# EAGLE design 10w_Adapter (EAGLE 9.4.2)
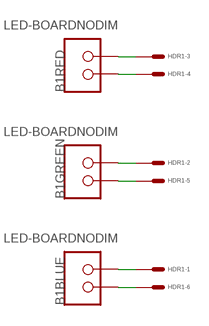
[diagram p0: schematic, sheet 1]

## Parts
B1  LED-BOARDNODIM  [LED_BOARD_V5_A]
HDR1  M06LOCK  [1X06_LOCK]

## Nets
N$1: B1.R- B1.R-@1 HDR1.3
N$2: B1.R+ B1.R+@1 HDR1.4
N$3: B1.G- B1.G-@1 HDR1.2
N$4: B1.G+ B1.G+@1 HDR1.5
N$5: B1.B- B1.B-@1 HDR1.1
N$6: B1.B+ B1.B+@2 HDR1.6

## Library data of the parts
B1 = myBoards:LED-BOARD
HDR1 = headers:M06: Header 6 Standard 6-pin 0.1" header. Use with straight break away headers (SKU : PRT-00116), right angle break away headers (PRT-00553), swiss pins (PRT-00743), machine pins (PRT-00117), and female headers (PRT-00115). Molex polarized connector foot print use with SKU : PRT-08094 with associated crimp pins and housings. NOTES ON THE VARIANTS LOCK and LOCK_LONGPADS... This footprint was designed to help hold the alignment of a through-hole component (i.e. 6-pin header) while soldering it into place. You may notice that each hole has been shifted either up or down by 0.005 of an inch from it's more standard position (which is a perfectly straight line). This slight alteration caused the pins (the squares in the middle) to touch the edges of the holes. Because they are alternating, it causes a "brace" to hold the component in place. 0.005 has proven to be the perfect amount of "off-center" position when using our standard breakaway headers. Although looks a little odd when you look at the bare footprint, once you have a header in there, the alteration is very hard to notice. Also, if you push a header all the way into place, it is covered up entirely on the bottom side. This idea of altering the position of holes to aid alignment will be further integrated into the Sparkfun Library for other footprints. It can help hold any component with 3 or more connection pins.

## Board
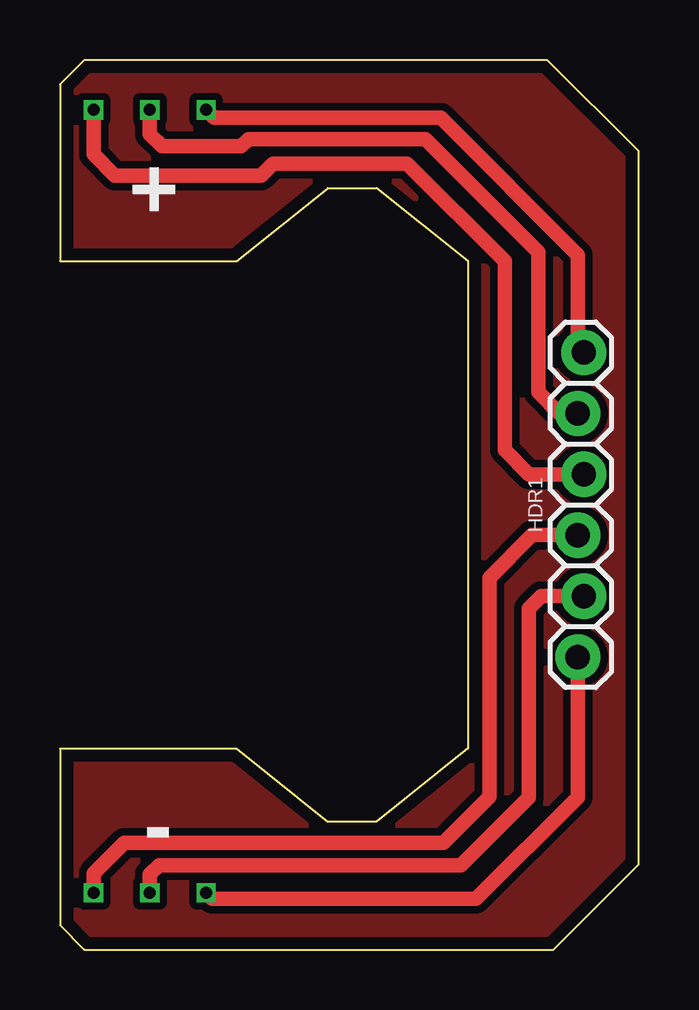
[diagram p1: board, top side]
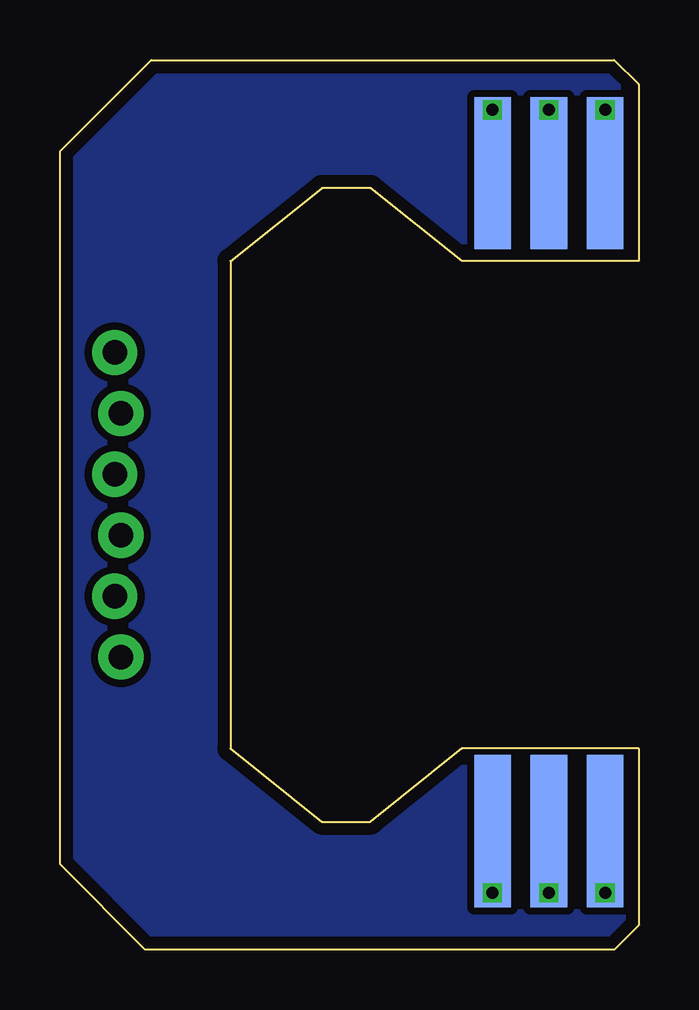
[diagram p2: board, bottom side, seen from below]

Size 24.13 x 37.08 mm. Coordinates in mm from the lower left corner, seen from the top.
Outline: 1.02,0 20.57,0 24.13,3.56 24.13,33.27 20.32,37.08 1.02,37.08 0,36.07 0,28.7 7.37,28.7 11.18,31.75 13.21,31.75 17.02,28.7 17.02,8.38 13.21,5.33 11.18,5.33 7.37,8.38 0,8.38 0,1.02 1.02,0
Copper layers (1*16): Top 0.035mm / dielectric 1.6mm / Bottom 0.035mm
Design rules "Elecrow_2-layer_PCB_eagle_rule": minimum track width 6mil, minimum drill 12mil, track to track 6mil, track to pad 6mil, pad to pad 6mil, via to via 8mil, smd to smd 6mil, copper to edge 20mil, drill to drill 10mil, minimum pad ring 6mil, minimum via ring 6mil, stop-mask expansion 0mil, vias tented up to drill 100mil, thermal gap 10mil

### Footprints (pad centres in the part's own frame; a part is rotated, then mirrored left to right if it is on the bottom)
LED_BOARD_V5_A = smd 1.524 x 6.35 bottom: B+ 6.095,36.683; B- 6.095,9.251; G+ 3.746,36.683; G- 3.746,9.251; R+ 1.396,36.683; R- 1.396,9.251 | drill 0.5 square: B+@2 6.095,39.324; B-@1 6.095,6.685; G+@1 3.746,39.324; G-@1 3.746,6.685; R+@1 1.396,39.324; R-@1 1.396,6.685
1X06_LOCK = drill 1.016 pad 1.88: 1 -6.35,0; 2 -3.81,-0.254; 3 -1.27,0; 4 1.27,-0.254; 5 3.81,0; 6 6.35,-0.254

### Placement (x,y rotation side)
B1  0,-4.32 0 top
HDR1  21.59,18.54 90 top

### Tracks (layer width: path | path; a pad name or v marks a point on that pad's centre or on a via)
GND
  pour Top (isolate 0.305): 0,1.27 0,1.02 1.02,0 20.57,0 24.13,3.68 24.13,33.27 20.32,37.08 1.02,37.08 0,36.07 0,28.7 7.37,28.7 11.18,31.75 13.21,31.75 17.02,28.7 17.02,8.38 13.21,5.33 11.18,5.33 7.37,8.38 0,8.38
  pour Bottom (isolate 0.305): 0,1.27 0,1.02 1.02,0 20.57,0 24.13,3.68 24.13,33.27 20.32,37.08 1.02,37.08 0,36.07 0,28.7 7.37,28.7 11.18,31.75 13.21,31.75 17.02,28.7 17.02,8.38 13.21,5.33 11.18,5.33 7.37,8.38 0,8.38
N$1
  Top 0.61: B1.R-@1 1.4,3.17 2.67,4.45 15.99,4.45 17.9,6.37 17.9,15.49 19.68,17.27 HDR1.3
  Bottom 0.61: B1.R- B1.R-@1
N$2
  Top 0.61: B1.R+@1 1.4,33.15 2.29,32.26 8.38,32.26 8.89,32.77 14.48,32.77 18.54,28.7 18.54,20.83 19.56,19.81 HDR1.4
  Bottom 0.61: B1.R+ B1.R+@1
N$3
  Top 0.61: HDR1.2 20.07,14.73 19.56,14.22 19.56,6.35 16.72,3.51 4.13,3.51 3.75,3.13 B1.G-@1
  Bottom 0.61: B1.G- B1.G-@1
N$4
  Top 0.61: B1.G+@1 3.75,33.99 4.25,33.48 7.56,33.48 7.86,33.78 15.24,33.78 19.94,29.08 19.94,23.24 20.83,22.35 HDR1.5
  Bottom 0.61: B1.G+ B1.G+@1
N$5
  Top 0.61: B1.B-@1 6.35,2.11 17.35,2.11 21.59,6.35 HDR1.1
  Bottom 0.61: B1.B- B1.B-@1
N$6
  Top 0.61: HDR1.6 21.59,25.15 21.59,28.96 15.88,34.67 6.43,34.67 B1.B+@2
  Bottom 0.61: B1.B+ B1.B+@2